# EAGLE design ads1115 (EAGLE 7.3.0)
PROJECT_AUTHOR: tinkerman.cat <xose.perez@gmail.com>; PROJECT_LICENSE: MIT; PROJECT_NAME: SONOFF EMON SENSOR ADAPTOR; PROJECT_VERSION: 0.1.20161209
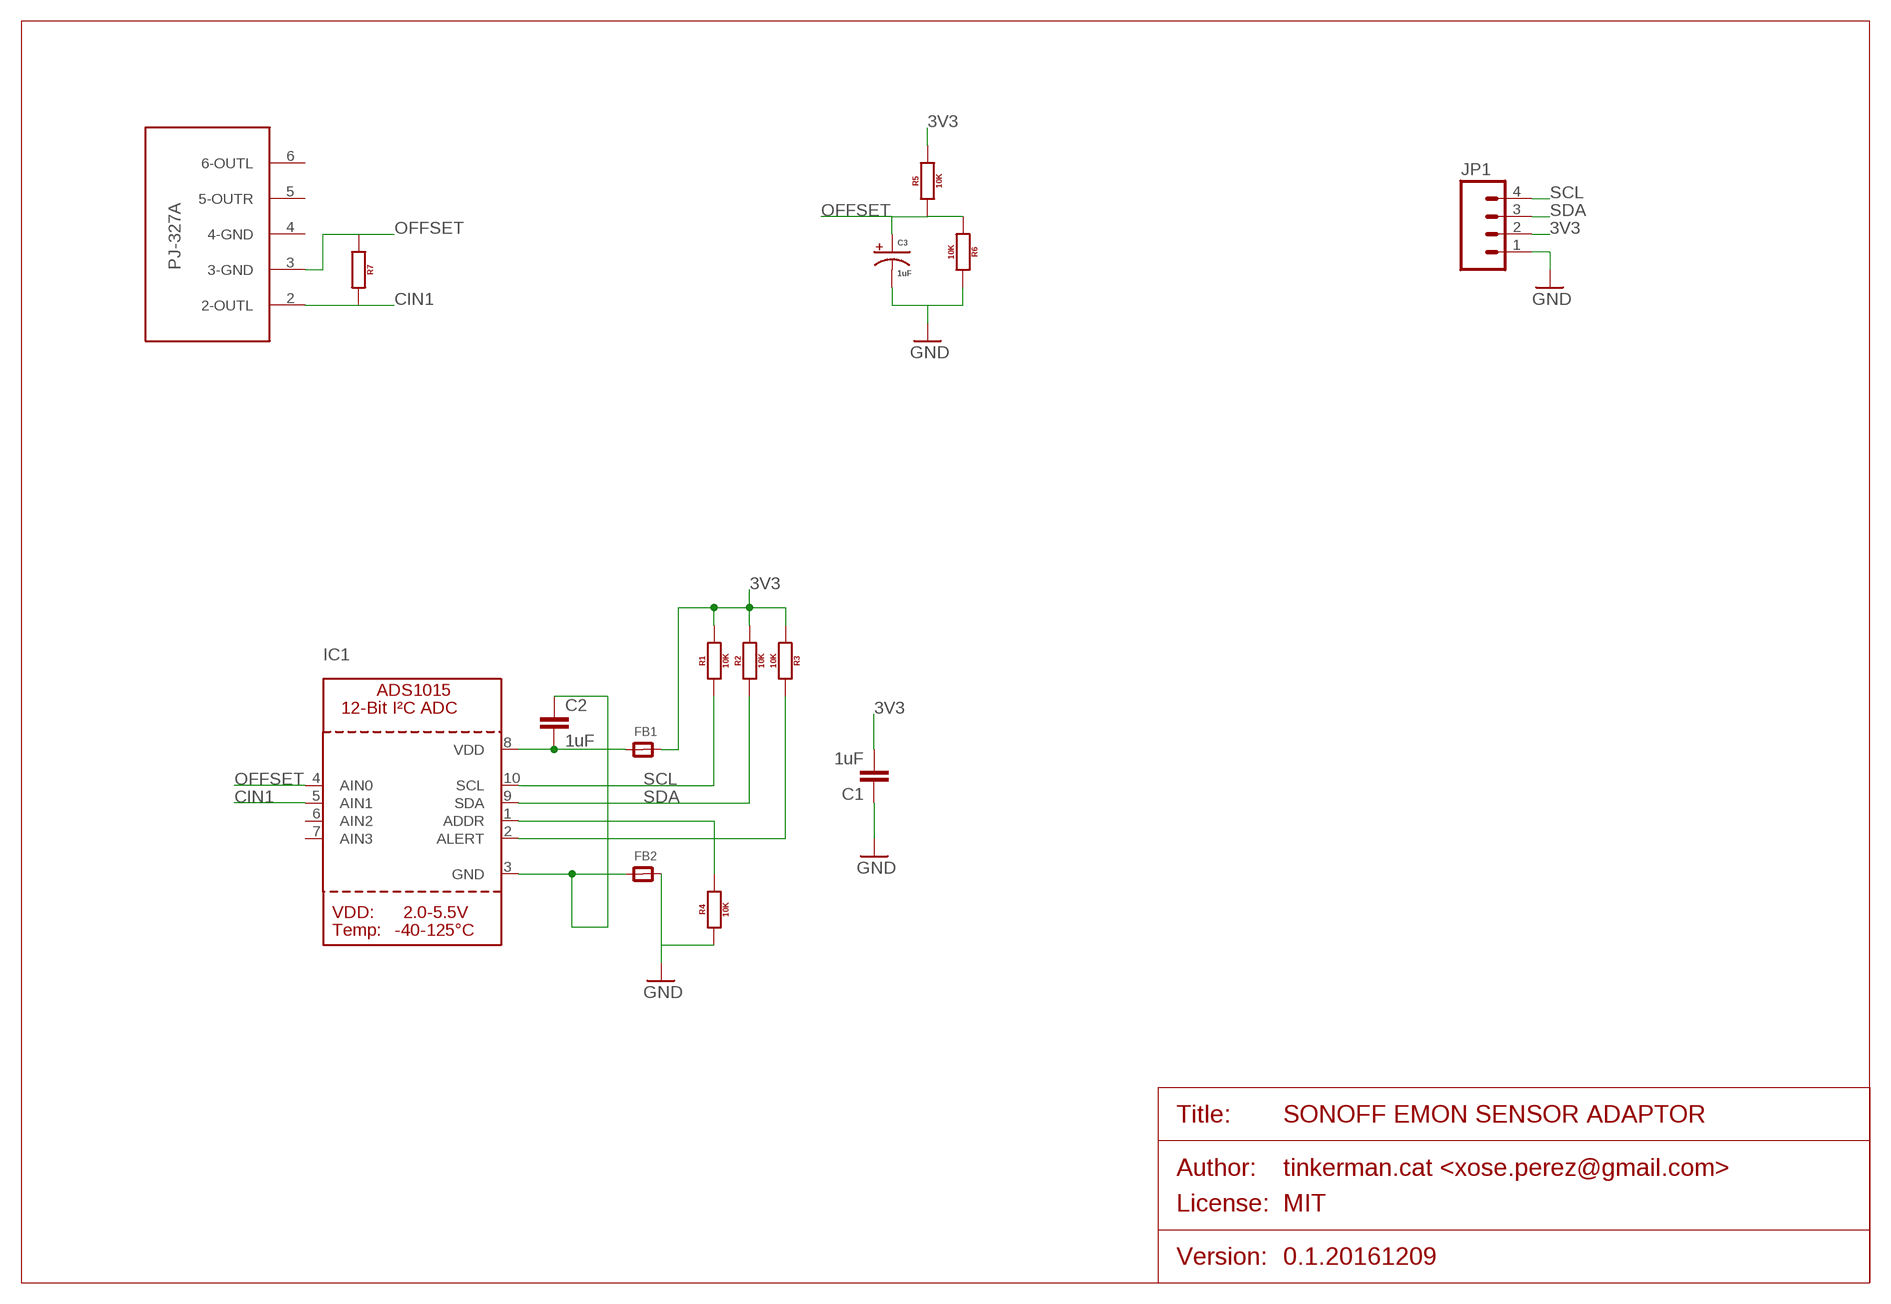
[diagram p0: schematic, sheet 1]

## Parts
C1  1uF  C-EU0805  [0805]
C2  1uF  C-EU0805  [0805]
C3  1uF  CAP_POLC  [PANASONIC_C]
CURR1  PJ-327A  [PJ-327A]
FB1  FERRITE_0805MP  [_0805MP]
FB2  FERRITE_0805MP  [_0805MP]
IC1  ADC_ADS1015  [MSOP10]
JP1  M04PTH  [1X04]
R1  10K  RESISTOR0805  [0805]
R2  10K  RESISTOR0805  [0805]
R3  10K  RESISTOR0805  [0805]
R4  10K  RESISTOR0805  [0805]
R5  10K  RESISTOR0805  [0805]
R6  10K  RESISTOR0805  [0805]
R7  RESISTOR0805  [0805]

## Nets
3V3: C1.2 FB1.2 JP1.2 R1.2 R2.2 R3.1 R5.2
CIN1: CURR1.2(2-OUTL) IC1.5(AIN1) R7.2
GND: C1.1 C3.- FB2.2 JP1.1 R4.1 R6.2
N$1: C2.2 FB1.1 IC1.8(VDD)
N$10: IC1.2(ALERT) R3.2
N$11: IC1.1(ADDR) R4.2
N$12: C2.1 FB2.1 IC1.3(GND)
OFFSET: C3.+ CURR1.3(3-GND) IC1.4(AIN0) R5.1 R6.1 R7.1
SCL: IC1.10(SCL) JP1.4 R1.1
SDA: IC1.9(SDA) JP1.3 R2.1
Unconnected: CURR1.4(4-GND) CURR1.5(5-OUTR) CURR1.6(6-OUTL) IC1.6(AIN2) IC1.7(AIN3)

## Library data of the parts
C1 C2 = xose:C-EU: CAPACITOR, European symbol
C3 = xose:CAP_POL: Capacitor Polarized These are standard SMD and PTH capacitors. Normally 10uF, 47uF, and 100uF in electrolytic and tantalum varieties. Always verify the external diameter of the through hole cap, it varies with capacity, voltage, and manufacturer. The EIA devices should be standard.
CURR1 = PJ-327A:PJ-327A
FB1 FB2 = microbuilder:FERRITE: Ferrite Bead 0603 MMZ1608B121C - 120 Ohm @ 100MHz, 600mA, 0.15 Ohm DC Resistance - Digikey: 445-2164-1-ND BK1608HW121-T - 120 Ohm, 600mA Ferrite Chip - Digikey: 587-1876-2-ND 0805 HZ0805B272R-10 - 2.7K Ohm @ 100MHz, 200mA, 0.8 Ohm DC Resistance - Digikey: 240-2504-1-ND (see also Murata BLM21BD272SN1L) MMZ2012Y152B - 1.5K Ohm @ 100MHz, 500mA, 0.4 Ohm DC Resistance - Digikey: 445-1560-1-ND - Mainly for high frequency (80-400MHz) MMZ2012R102A - 1K Ohm @ 100MHz, 500mA, 0.3 Ohm DC Resistance - Digikey: 445-1555-2-ND - More general purpose (10-200MHz)
IC1 = microbuilder:ADC_ADS1015: ADS1015 - 12-bit 4-Channel I2C ADC with Internal PGA VDD: 2.0-5.5V Sampling Rate: 3.3ksps Gain Settings: 2/3, 1, 2, 4, 8, 16 I2C Address: ADDR low = 1001000x, ADDR high = 1001001x Internal Comparator The ADS1015 includes an internal comparator that can be set to output a high-level on ALERT when the conversion results exceeeds a pre-defined upper level, and will deassert itself when the level falls below a pre-defined lower threshold level. It can also be set to windowed mode where the ALERT pin will be asserted if the data exceeds the upper threshold or falls below the lower threshold.
JP1 = xose:M04: Header 4 Standard 4-pin 0.1" header. Use with straight break away headers (SKU : PRT-00116), right angle break away headers (PRT-00553), swiss pins (PRT-00743), machine pins (PRT-00117), and female headers (PRT-00115). Molex polarized connector foot print use with SKU : PRT-08231 with associated crimp pins and housings. 1MM SMD Version SKU: PRT-10208
R1-R7 = xose:RESISTOR: Generic EU resistor symbol

## Board
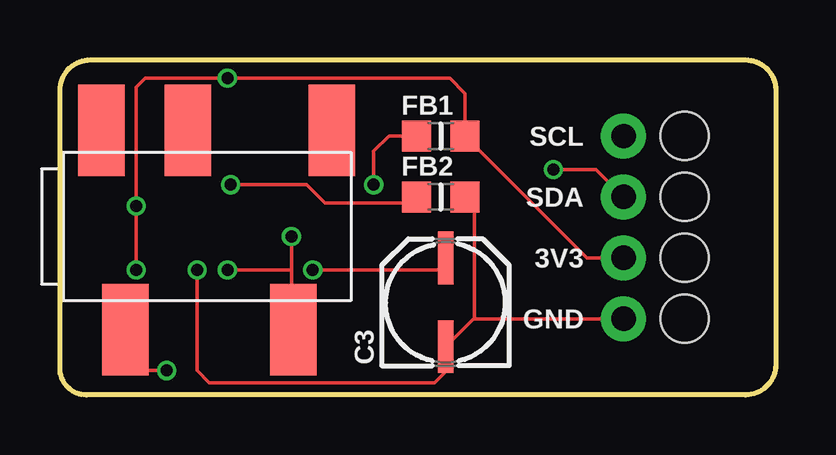
[diagram p1: board, top side]
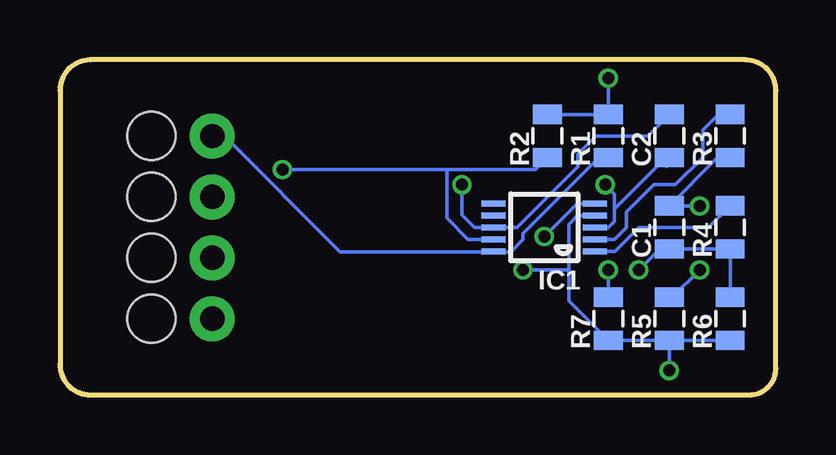
[diagram p2: board, bottom side, seen from below]

Size 29.84 x 13.97 mm. Coordinates in mm from the lower left corner, seen from the top.
Outline: 0,1.09 0,12.7 arc-90 1.27,13.97 28.57,13.97 arc-90 29.84,12.7 29.84,1.27 arc-90 28.59,0 1.09,0 arc-90 0,1.09
Copper layers (1*16): Top 0.035mm / dielectric 1.5mm / Bottom 0.035mm
Design rules "seedstudio-2layer": minimum track width 6mil, minimum drill 12mil, track to track 6mil, track to pad 6mil, pad to pad 6mil, via to via 6mil, smd to smd 0mil, copper to edge 10mil, drill to drill 10mil, minimum pad ring 10mil, minimum via ring 6mil, stop-mask expansion 2mil, vias tented up to drill 100mil, thermal gap 10mil
Holes 2 mm at 26.04,10.79 26.04,5.71 26.04,8.26 26.04,3.17

### Footprints (pad centres in the part's own frame; a part is rotated, then mirrored left to right if it is on the bottom)
0805 = smd 0.8 x 1.2: 1 -0.9,0; 2 0.9,0
PANASONIC_C = smd 2.2 x 0.65: + 1.9,-0.2; - -1.8,-0.2
PJ-327A = smd 1.93 x 3.81: 2 9.1,-6.8; 3 2.1,-6.8; 4 1.1,1.5; 5 4.7,1.5; 6 10.7,1.5
_0805MP = smd 1.2 x 1.3: 1 -1.016,0; 2 1.016,0
MSOP10 = smd 0.25 x 1: 1 -1,-2.113; 2 -0.5,-2.113; 3 0,-2.113; 4 0.5,-2.113; 5 1,-2.113; 6 1,2.113; 7 0.5,2.113; 8 0,2.113; 9 -0.5,2.113; 10 -1,2.113
1X04 = drill 1.016 pad 1.88: 1 0,0; 2 2.54,0; 3 5.08,0; 4 7.62,0

### Placement (x,y rotation side)
C1  4.45,6.99 90 bottom
C2  4.45,10.79 90 bottom
C3  15.88,3.81 90 top
CURR1  0.64,9.53 0 top
FB1  15.88,10.79 0 top
FB2  15.88,8.26 0 top
IC1  9.65,6.99 90 bottom
JP1  23.5,3.17 90 top
R1  6.99,10.79 90 bottom
R2  9.53,10.79 90 bottom
R3  1.91,10.79 90 bottom
R4  1.91,6.99 90 bottom
R5  4.45,3.17 90 bottom
R6  1.91,3.17 90 bottom
R7  6.99,3.17 90 bottom

### Tracks (layer width: path | path; a pad name or v marks a point on that pad's centre or on a via)
3V3  (via drill 0.5)
  Top 0.152: JP1.2 21.97,5.71 FB1.2 16.89,12.57 16.26,13.21 v6.99,13.21 3.56,13.21 3.17,12.83 v3.17,7.87 v3.17,5.21
  Bottom 0.152: R3.1 2.44,9.89 C1.2 4.43,7.87 v3.17,7.87 | R2.2 R1.2 v6.99,13.21 | R5.2 4.31,4.08 v3.17,5.21
CIN1  (via drill 0.5)
  Top 0.152: CURR1.2 9.65,2.81 9.65,5.21 | 9.65,5.21 v9.65,6.6 | v6.99,5.21 9.65,5.21
  Bottom 0.152: v9.65,6.6 8.27,7.99 IC1.5 | v6.99,5.21 R7.2
GND  (via drill 0.5)
  Top 0.152: 17.24,3.17 C3.- 16.13,1.96 16.13,1.02 15.62,0.51 6.22,0.51 5.71,1.02 v5.71,5.21 | 17.24,3.17 JP1.1 | 17.24,3.17 17.27,3.21 17.27,7.75 16.89,8.13 FB2.2
  Bottom 0.152: R6.2 R4.1 C1.1 4.84,6.08 v5.71,5.21
N$1  (via drill 0.5)
  Top 0.152: FB1.1 13.72,10.79 13.08,10.16 v13.08,8.76
  Bottom 0.152: C2.2 5.34,10.79 7.49,10.79 8.26,10.03 8.26,9.53 10.79,6.99 IC1.8 12.57,6.99 13.08,7.49 v13.08,8.76
N$10
  Bottom 0.152: IC1.2 7.53,6.48 6.73,6.48 6.22,6.99 6.22,7.62 5.08,8.76 4.19,8.76 3.05,9.91 3.05,11.05 2.4,11.7 R3.2
N$11
  Bottom 0.152: R4.2 2.81,6.99 5.71,6.99 6.71,5.99 IC1.1
N$12  (via drill 0.5)
  Top 0.152: FB2.1 14.61,8 11.05,8 10.29,8.76 v7.11,8.76
  Bottom 0.152: 4.57,9.53 4.57,9.77 C2.1 4.58,9.89 6.73,7.75 | 7.24,6.99 IC1.3 6.99,6.99 6.73,7.24 6.73,7.75 | v7.11,8.76 6.73,8.38 6.73,7.75
OFFSET  (via drill 0.5)
  Top 0.152: CURR1.3 2.79,1.02 v4.45,1.02 | C3.+ 16.08,5.21 v10.54,5.21
  Bottom 0.152: R6.1 R5.1 | R5.1 R7.1 8.64,3.93 8.64,5.21 | v4.45,1.02 R5.1 | 8.64,5.21 8.64,7.11 8.26,7.49 IC1.4 | v10.54,5.21 8.64,5.21
SCL
  Bottom 0.152: 7.25,9.89 R1.1 7.38,9.89 10.54,6.73 10.54,6.48 11.05,5.97 11.75,5.97 IC1.10 11.78,5.97 18.16,5.97 22.99,10.79 JP1.4
SDA  (via drill 0.5)
  Top 0.152: v20.57,9.4 22.35,9.4 JP1.3
  Bottom 0.152: IC1.9 11.77,6.48 12.83,6.48 13.72,7.37 13.72,9.4 | R2.1 10.02,9.4 13.72,9.4 | 13.72,9.4 v20.57,9.4

### Text on the board
tNames: SCL | SDA | 3V3 | GND